# Altium schematic sheet Power-SMPS.SchDoc: Power-SMPS
size Letter; DocumentNumber: 5; SheetNumber: 2; SheetTotal: 11
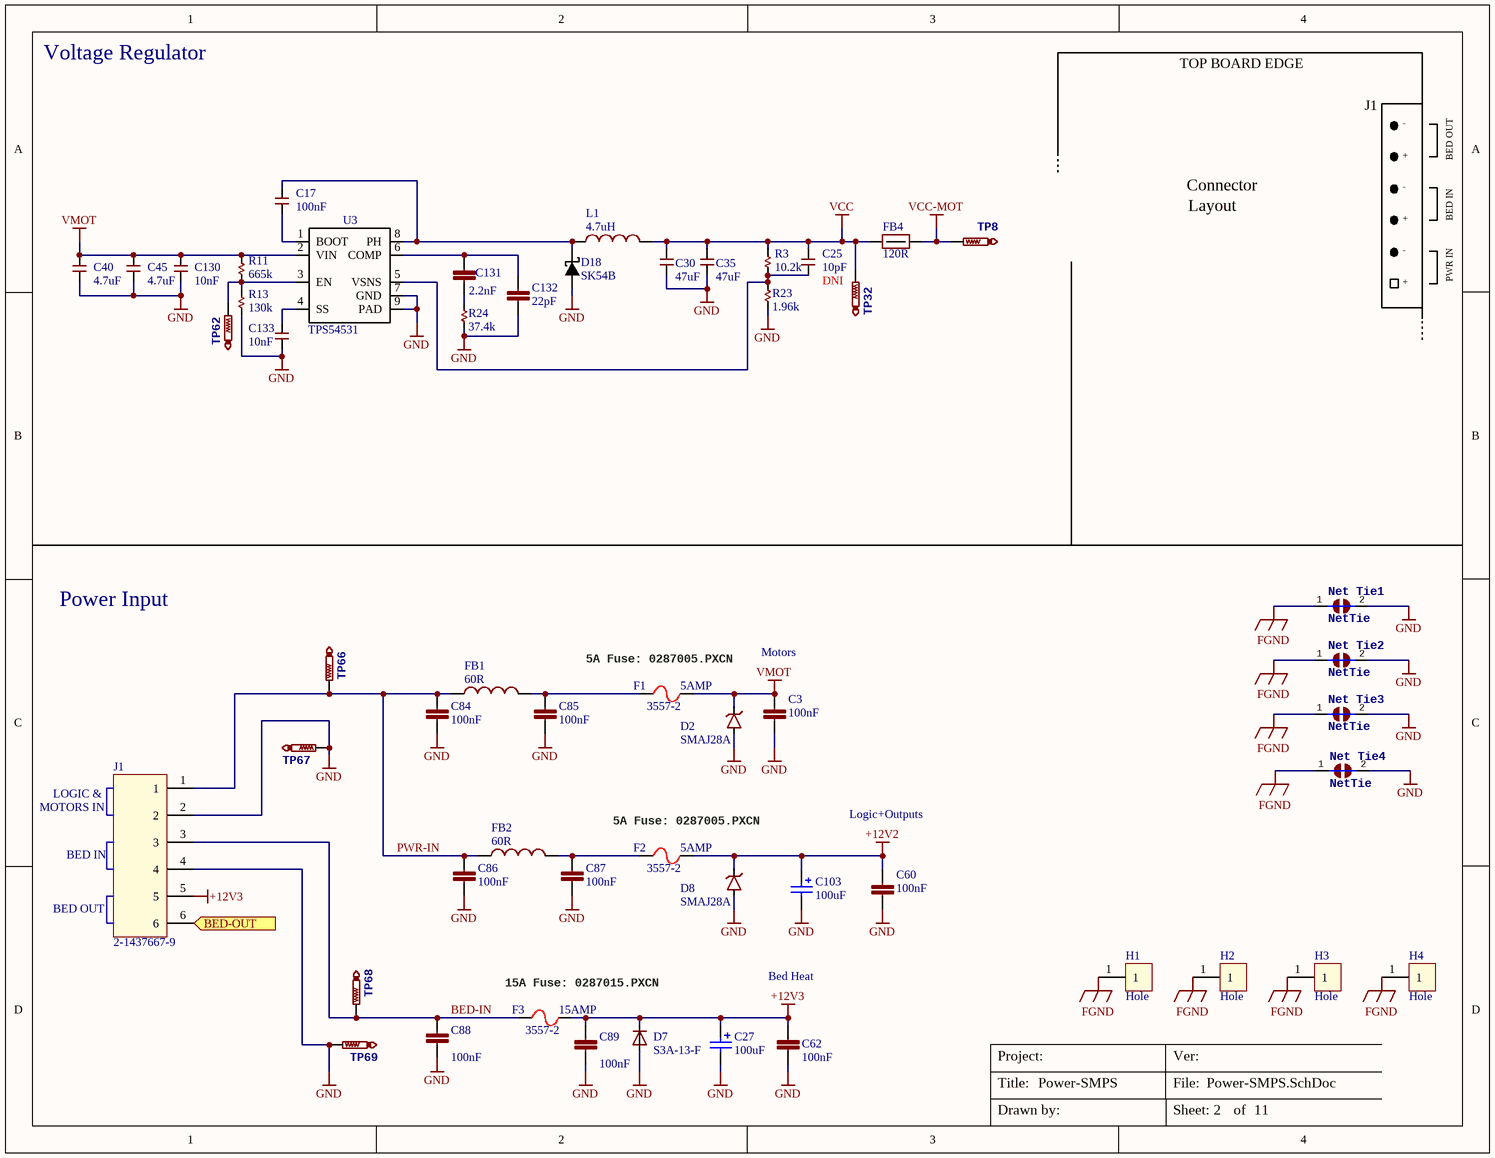
[diagram p0: Power-SMPS.SchDoc]

## Parts
C3  100nF  [C0603]
C17  100nF  [C0603]
C25  10pF  [C0402]
C27  value 100uF  [CAP-ELEC-063063077]  (hidden comment: UWT1V101MCL1GS)
C30  47uF  [C1210]
C35  47uF  [C1210]
C40  4.7uF  [C1210]
C45  4.7uF  [C1210]
C60  100nF  [C0603]
C62  100nF  [C0603]
C84  100nF  [C0603]
C85  100nF  [C0603]
C86  100nF  [C0603]
C87  100nF  [C0603]
C88  100nF  [C0603]
C89  100nF  [C0603]
C103  value 100uF  [CAP-ELEC-063063077]  (hidden comment: UWT1V101MCL1GS)
C130  10nF  [C0402]
C131  2.2nF  [C0402]
C132  22pF  [C0402]
C133  10nF  [C0402]
D2  SMAJ28A  [SMA-SM]
D7  S3A-13-F  [DO-214AB]
D8  SMAJ28A  [SMA-SM]
D18  SK54B  [SMB_DO-214AA_LRG]
F1  3557-2  [3557]
F2  3557-2  [3557]
F3  3557-2  [3557]
FB1  value 60R  [L1806]  (hidden comment: BLM41PG600SN1L)
FB2  value 60R  [L1806]  (hidden comment: BLM41PG600SN1L)
FB4  120R  [FB0603]
H1  Hole  [Wave_hole_3x7-singleSided]  (no BOM)
H2  Hole  [Wave_hole_3x7-singleSided]  (no BOM)
H3  Hole  [Wave_hole_3x7-singleSided]  (no BOM)
H4  Hole  [Wave_hole_3x7-singleSided]  (no BOM)
J1  2-1437667-9  [CON-Barrier-6-8.26mm]
L1  4.7uH  [IND_10X10]
Net_Tie1  NetTie  [Net Tie]  (net tie, no BOM)
Net_Tie2  NetTie  [Net Tie]  (net tie, no BOM)
Net_Tie3  NetTie  [Net Tie]  (net tie, no BOM)
Net_Tie4  NetTie  [Net Tie]  (net tie, no BOM)
R3  10.2k  [R0402]
R11  665k  [R0402]
R13  130k  [R0402]
R23  1.96k  [R0402]
R24  37.4k  [R0402]
TP8  TestPoint  [TP1-27]  (value not drawn)  (no BOM)
TP32  TestPoint  [TP1-27]  (value not drawn)  (no BOM)
TP62  TestPoint  [TP1-27]  (value not drawn)  (no BOM)
TP66  TestPoint  [TP1-27]  (value not drawn)  (no BOM)
TP67  TestPoint  [TP1-27]  (value not drawn)  (no BOM)
TP68  TestPoint  [TP1-27]  (value not drawn)  (no BOM)
TP69  TestPoint  [TP1-27]  (value not drawn)  (no BOM)
U3  TPS54531  [SOIC127P600X170_HS-9L]

## Ports
BED-OUT

## Nets
+12V2: C60.1 C103.1 D8.K F2.2
+12V3: C27.1 C62.1 C89.1 D7.C F3.2 J1.5
FGND: H1.1 H2.1 H3.1 H4.1 Net_Tie1.1 Net_Tie2.1 Net_Tie3.1 Net_Tie4.1
GND: C3.2 C27.2 C30.1 C35.1 C40.1 C45.1 C60.2 C62.2 C84.2 C85.2 C86.2 C87.2 C88.2 C89.2 C103.2 C130.1 C132.1 C133.1 D2.A D7.A D8.A D18.A(ANODE) J1.2 J1.4 Net_Tie1.2 Net_Tie2.2 Net_Tie3.2 Net_Tie4.2 R13.1 R23.1 R24.1 TP67.TP TP69.TP U3.7(GND) U3.9(PAD)
VCC: C25.2 C30.2 C35.2 FB4.1 L1.2 R3.1 TP32.TP
VCC-MOT: FB4.2 TP8.TP
VMOT: C3.1 C40.2 C45.2 C130.2 D2.K F1.2 R11.2 U3.2(VIN)
BED-IN: C88.1 F3.1 J1.3 TP68.TP
BED-OUT: J1.6 ; port BED-OUT
PWR-IN: C84.1 C86.1 FB1.1 FB2.1 J1.1 TP66.TP
NetC17_1: C17.1 U3.1(BOOT)
NetC17_2: C17.2 D18.K(CATHODE) L1.1 U3.8(PH)
NetC25_1: C25.1 R3.2 R23.2 U3.5(VSNS)
NetC85_1: C85.1 F1.1 FB1.2
NetC87_1: C87.1 F2.1 FB2.2
NetC131_1: C131.1 R24.2
NetC131_2: C131.2 C132.2 U3.6(COMP)
NetC133_2: C133.2 U3.4(SS)
NetR11_1: R11.1 R13.2 TP62.TP U3.3(EN)

## Notes on the sheet
- Voltage Regulator
- TOP BOARD EDGE
- J1
- +
- -
- BED OUT
- Connector
- Layout
- BED IN
- PWR IN
- Power Input
- (near F1) 5A Fuse: 0287005.PXCN
- (near F1) 5AMP
- Motors
- MOTORS IN
- LOGIC &
- (near F2) 5A Fuse: 0287005.PXCN
- Logic+Outputs
- (near F2) 5AMP
- (near F3) 15A Fuse: 0287015.PXCN
- (near F3) 15AMP
- Bed Heat
- Title:
- Project:
- File:
- Ver:
- Drawn by:
- Sheet:
- of

## Library data of the parts
C3 C60 C62 C84-C89 = C0603C104K5RACTU: CAP CER 0603 100nF 50V 10% X7R; Manufacturer: Kemet; Part Description: 0.1µF ±10% 50V Ceramic Capacitor X7R 0603 (1608 Metric); EE_SPEC: 100nF 50V X7R 0603; Tolerance: +/- 10%; VALUE: 100nF; MANUFACTURER #: C0603C104K5RACTU; DISTRIBUTOR #: 399-5089-2-ND; DISTRIBUTOR: Digi-Key; PART: 100nF
C17 = 100nF 0603 50V X7R: CAP CER 0603 100nF 50V 10% X7R; MANUFACTURER: Kemet; MANUFACTURER #: C0603C104K5RACTU; PART DESCRIPTION: 0.1µF ±10% 50V Ceramic Capacitor X7R 0603 (1608 Metric); TOLERANCE: +/- 10%; EE_SPEC: 100nF 50V X7R 0603; DISTRIBUTOR #: 399-5089-2-ND; DISTRIBUTOR: Digi-Key; PART: 100nF; VALUE: 100nF
C25 = 10pF 0402 50V NP0: CAP CER 10PF 50V 5% NP0 0402; PART DESCRIPTION: 10pF ±5% 50V Ceramic Capacitor C0G, NP0 0402 (1005 Metric); MANUFACTURER #: CL05C100JB5NNNC; MANUFACTURER: Samsung; PART: 10pF 50V NP0 0402; TOLERANCE: 5%; EE_SPEC: 50V; DISTRIBUTOR #: 1276-1139-2-ND; DISTRIBUTOR: Digikey; DNI: DNI; VALUE: 10pF
C27 C103 = UWT1V101MCL1GS: CAP ALUM 100UF 35V 20% SMD; Manufacturer: Nichicon; Part Description: 100µF 35V Aluminum Capacitors Radial, Can - SMD 1000 Hrs @ 105°C; EE_SPEC: 100uF 35V Al-El; Tolerance: +/- 20%; MANUFACTURER #: UWT1V101MCL1GS; DISTRIBUTOR #: 493-2203-2-ND; DISTRIBUTOR: Digi-Key; PART: 100uF
C30 C35 = 47uF 1210 10V X5R: CAP CER 47UF 10V X5R 1210; MANUFACTURER: Murata; MANUFACTURER #: GRM32ER61A476KE20L; PART DESCRIPTION: 47µF ±10% 10V Ceramic Capacitor X5R 1210 (3225 Metric); TOLERANCE: 10%; EE_SPEC: 10V, 3mOhm; DISTRIBUTOR #: 490-3887-1-ND; DISTRIBUTOR: Digikey; PART: 47uF; VALUE: 47uF
C40 C45 = 4.7uF 1210 50V X7R: CAP CER 4.7UF 50V X7R 1210; MANUFACTURER: Murata; MANUFACTURER #: GRM32ER71H475KA88L; PART DESCRIPTION: 4.7µF ±10% 50V Ceramic Capacitor X7R 1210 (3225 Metric); TOLERANCE: 10%; DISTRIBUTOR #: 490-1864-1-ND; DISTRIBUTOR: Digikey; PART: 4.7uF 1210 50V X7R; EE_SPEC: 50V; VALUE: 4.7uF
C130 C133 = 10nF 0402 50V X7R: CAP CER 10nF 50V X7R 0402; PART DESCRIPTION: 10000pF ±5% 50V Ceramic Capacitor X7R 0402 (1005 Metric); MANUFACTURER #: GRM155R71H103JA88D; MANUFACTURER: Murata; TOLERANCE: 5%; EE_SPEC: 50V; DISTRIBUTOR #: 490-7763-1-ND; DISTRIBUTOR: Digikey; PART: 10nF 50V X7R 0402; VALUE: 10nF
C131 = 2.2nF 25V C0G 0402: CAP CER 0402 2.2nF 25V C0G; MANUFACTURER: Kemet; MANUFACTURER #: C0402C222J3GACTU; PART DESCRIPTION: 2200pF ±5% 25V Ceramic Capacitor C0G, NP0 0402 (1005 Metric); EE_SPEC: 25; TOLERANCE: 5%; VALUE: 2.2nF; DISTRIBUTOR #: 399-8957-2-ND; DISTRIBUTOR: Digikey; PART: 2.2nF 25V C0G 0402
C132 = 22pF 0402 50V C0G: CAP CER 0402 22pF 50V 5% C0G; Manufacturer: AVX; MANUFACTURER #: 04025A220JAT2A; Part Description: 22pF ±5% 50V Ceramic Capacitor C0G, NP0 0402 (1005 Metric); EE_SPEC: 22pF 5% 50V NP0 0402; VALUE: 22pF; DISTRIBUTOR #: 478-1074-2-ND; DISTRIBUTOR: Digi-Key; PART: 22pF 50V; Tolerance: 5%
D2 D8 = SMAJ28A: TVS DIODE 28VWM 45.4VC SMA; Manufacturer: Diodes Inc; MANUFACTURER #: SMAJ28A-13-F; EE_SPEC: 28Vrs 45.4Vc; Tolerance: NA; DISTRIBUTOR #: SMAJ28A-FDITR-ND; DISTRIBUTOR: Digi-Key; PART: SMAJ28A; Part Description: TVS DIODE 28VWM 45.4VC SMA; VALUE: SMAJ28A
D7 = S3A-13-F: DIODE DO-214AB; Manufacturer: Diodes Incorporated; Part Description: Diode Standard 50V 3A Surface Mount SMC; EE_SPEC: 50V 3A 1.15Vf; Tolerance: NA; Value: S3A-13-F; DISTRIBUTOR #: S3A-FDITR-ND; DISTRIBUTOR: Digi-Key; MANUFACTURER #: S3A-13-F; PART: S3A-13-F
D18 = SK54B: DIODE SCHOTTKY 40V 5A SMB_DO214AA; MANUFACTURER: MCC; MANUFACTURER #: SK54B-LTP; VOLTAGE: 40Vrb; PART: SK54B; DISTRIBUTOR: DIGI-KEY; DISTRIBUTOR #: SK54B-LTPMSTR-ND
F1-F3 = 3557-2: FUSE PTH ATO; Manufacturer: Keystone; Part Description: FUSE BLOCK BLADE 500V 30A PCB; EE_SPEC: ATC 500V 30A; Tolerance: NA; MANUFACTURER #: 3557-2; DISTRIBUTOR #: 36-3557-2-ND; DISTRIBUTOR: Digi-Key; PART: Fuse; VALUE: Fuse
FB1 FB2 = BLM41PG600SN1L: FERRITE BEAD 1806 60ohm; Manufacturer: Murata; PART: 60Rf; Part Description: FERRITE BEAD 60 OHM 1806 1LN; EE_SPEC: 60R 6A 0.009Ohm; Tolerance: NA; MANUFACTURER #: BLM41PG600SN1L; DISTRIBUTOR #: 490-1058-2-ND; DISTRIBUTOR: Digi-Key
FB4 = FERRITE 120R 3A 0603: FERRITE BEAD 120 OHM 0603 1LN; MANUFACTURER: Samsung; MANUFACTURER #: CIS10P121AC; VALUE: 120Rfb; TOLERANCE: -NA-; EE_SPEC: 3A; DISTRIBUTOR #: 1276-6351-2-ND; DISTRIBUTOR: DigiKey; PART: FERRITE 120R 3A 0603; PART DESCRIPTION: FERRITE BEAD 120 OHM 0603 1LN
J1 = 2-1437667-9: CONN BARRIER STRIP 6CIRC 0.325"; MANUFACTURER #: 4DB-P108-06; Manufacturer: TE; PART: 6POS; Part Description: 6 Circuit 0.325" (8.26mm) Barrier Block Connector, Screws with Captive Plate; EE_SPEC: 150V 2A; Tolerance: NA; VALUE: 6POS; DISTRIBUTOR #: A98476-ND; DISTRIBUTOR: Digi-Key
L1 = 4.7uH 10A: FIXED IND 4.7UH 10A 15.5 MOHM; Manufacturer: Bourns; MANUFACTURER #: SRP1038A-4R7M; Part Description: 4.7µH Shielded Wirewound Inductor 10A 15.5 mOhm Max Nonstandard; EE_SPEC: Irms=10A, Isat=17A, DCR=0.016Ohms; Tolerance: +/- 20%; Value: 4.7uH; DISTRIBUTOR #: SRP1038A-4R7MTR-ND; DISTRIBUTOR: Digi-Key; PART: 4.7uH 10A
Net_Tie1-Net_Tie4 = NetTie: Net Tie; LastRevisionNote: ImportComponents; Published: 23-Apr-2014; Publisher: UltiMachine; LastRevisionDate: 23-Apr-2014
R3 = 10.2k 1% 0402: RES SMD 10.2K OHM 1% 1/16W 0402; MANUFACTURER: Yageo; MANUFACTURER #: RC0402FR-0710K2L; PART DESCRIPTION: 10.2 kOhms ±1% 0.063W, 1/16W Chip Resistor 0402 (1005 Metric) Moisture Resistant Thick Film; DISTRIBUTOR #: YAG2950TR-ND; DISTRIBUTOR: Digikey; PART: 10.2k 1% 0402; TOLERANCE: 1%; EE_SPEC: 1/16W; VALUE: 10.2k
R11 = 665k 1% 0402: RES SMD 665K OHM 1% 1/16W 0402; MANUFACTURER: Yageo; MANUFACTURER #: RC0402FR-07665KL; PART DESCRIPTION: 665 kOhms ±1% 0.063W, 1/16W Chip Resistor 0402 (1005 Metric) Moisture Resistant Thick Film; DISTRIBUTOR #: YAG2374CT-ND; DISTRIBUTOR: Digikey; PART: 665k 1% 0402; TOLERANCE: 1%; EE_SPEC: 1/16W; VALUE: 665k
R13 = 130k 1% 0402: RES SMD 130K OHM 5% 1/16W 0402; MANUFACTURER: Yageo; MANUFACTURER #: RC0402JR-07130KL; PART DESCRIPTION: 130 kOhms ±5% 0.063W, 1/16W Chip Resistor 0402 (1005 Metric) Moisture Resistant Thick Film; TOLERANCE: 1%; DISTRIBUTOR #: YAG3273CT-ND; DISTRIBUTOR: Digikey; PART: 130k 1% 0402; EE_SPEC: 1/16W; VALUE: 130k
R23 = 1.96k 1% 0402: RES SMD 1.96K OHM 1% 1/16W 0402; MANUFACTURER: Yageo; MANUFACTURER #: RC0402FR-071K96L; PART DESCRIPTION: 1.96 kOhms ±1% 0.063W, 1/16W Chip Resistor 0402 (1005 Metric) Moisture Resistant Thick Film; VALUE: 1.96k; DISTRIBUTOR #: 311-1.96KLRTR-ND; DISTRIBUTOR: Digikey; EE_SPEC: 1/16W; PART: 1.96k 1% 0402; TOLERANCE: 1%
R24 = 37.4K 1% 0402: RES SMD 37.4K OHM 1% 1/16W 0402; MANUFACTURER: Yageo; MANUFACTURER #: RC0402FR-0737K4L; PART DESCRIPTION: 37.4 kOhms ±1% 0.063W, 1/16W Chip Resistor 0402 (1005 Metric) Moisture Resistant Thick Film; DISTRIBUTOR #: YAG3138CT-ND; DISTRIBUTOR: Digikey; PART: 37.4k; TOLERANCE: 1%; EE_SPEC: 1/16W; VALUE: 37.4k
TP8 TP32 TP62 TP66-TP69 = TestPoint: Test Point
U3 = TPS54531: IC REG BUCK ADJ 5A 8SOPWRPAD; MANUFACTURER #: TPS54531DDAR; MANUFACTURER: TI; PART DESCRIPTION: Buck Switching Regulator IC Positive Adjustable 0.8V 1 Output 5A 8-PowerSOIC (0.154", 3.90mm Width); EE_SPEC: 28Vin_max, 5A, 570kHz; VALUE: TPS54531; DISTRIBUTOR #: 296-40801-2-ND; DISTRIBUTOR: Digikey; PART: TPS54531